# Altium project Insigni.PrjPcb
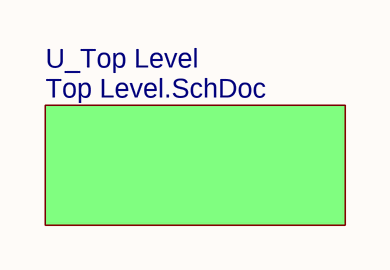
[diagram p0: System Diagram.SchDoc]
Revision: V1.0; DrawnBy: Ketan Desai; DateDrawn: 12-05-23
6 sheets, 6 parts. Net scope: global (net labels, ports and power ports of the same name join across sheets).
Sheets:
  System Diagram.SchDoc
    U_Top Level = Top Level.SchDoc
      U_MCU = MCU.SchDoc
      U_Analog Front End = Analog Front End.SchDoc
      U_CODEC = CODEC.SchDoc
      U_Power = Power.SchDoc

## Sheet System Diagram.SchDoc: System Diagram
size A4; SheetNumber: 1; SheetTotal: 6

### Sub-sheets
U_Top Level = Top Level.SchDoc: no entries

### Notes on the sheet
- TITLE
- DRAWN BY
- DATE
- PROJECT
- FILE
- SHEET SIZE
- A4
- REVISION
- PAGE
- of

## Sheet Top Level.SchDoc: Top Level
size A4; SheetNumber: 2; SheetTotal: 6
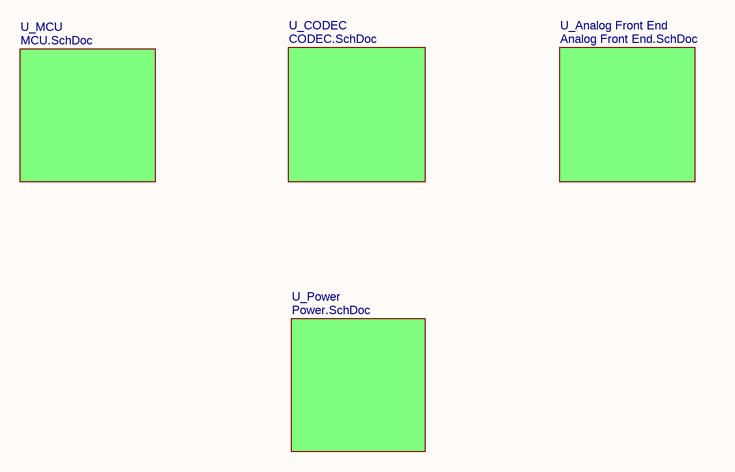
[diagram p1: Top Level.SchDoc]

### Sub-sheets
U_Analog Front End = Analog Front End.SchDoc: no entries
U_CODEC = CODEC.SchDoc: no entries
U_MCU = MCU.SchDoc: no entries
U_Power = Power.SchDoc: no entries

### Notes on the sheet
- TITLE
- DRAWN BY
- DATE
- PROJECT
- FILE
- SHEET SIZE
- A4
- REVISION
- PAGE
- of

## Sheet MCU.SchDoc: Microcontroller
size A4; SheetNumber: 3; SheetTotal: 6
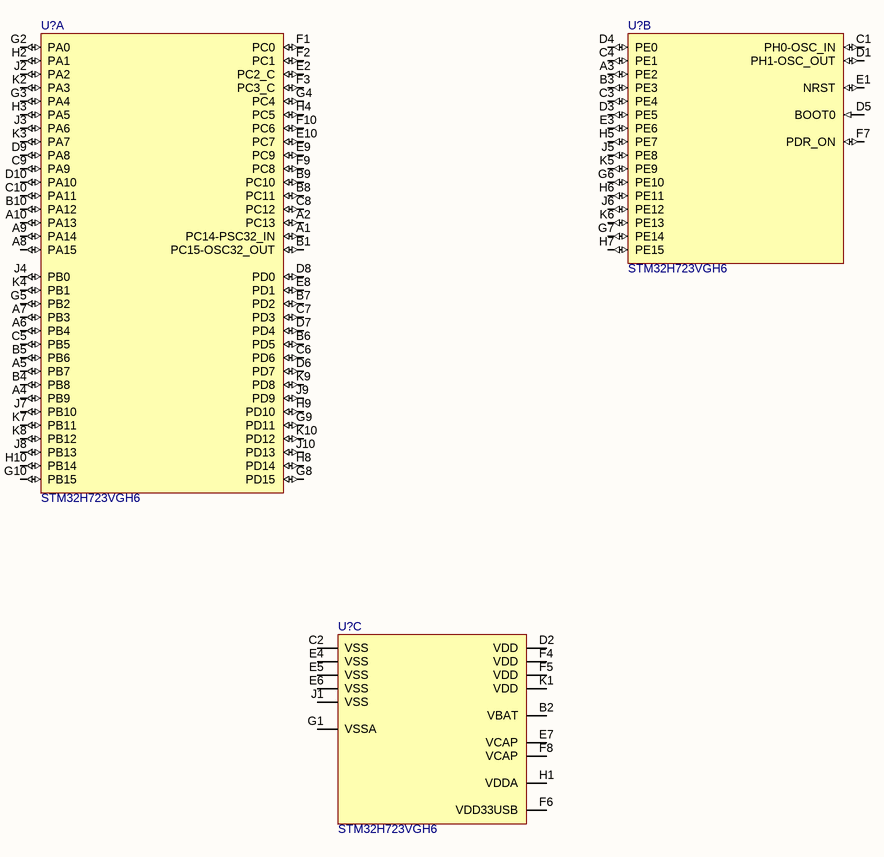
[diagram p2: MCU.SchDoc]

### Parts
(Parts that share a designator on the sheet are numbered #1, #2 ... from top to bottom, then left to right.)
U?#1  STM32H723VGH6  [TFBGA100_STM]  (part B of 3)
U?#2  STM32H723VGH6  [TFBGA100_STM]  (part A of 3)
U?#3  STM32H723VGH6  [TFBGA100_STM]  (part C of 3)

### Nets

Not connected (* = marked no-connect by the designer): U?#1 A3(PE2) B3(PE3) C1(PH0-OSC_IN) C3(PE4) C4(PE1) D1(PH1-OSC_OUT) D3(PE5) D4(PE0) D5(BOOT0) E1(NRST) E3(PE6) F7(PDR_ON) G6(PE10) G7(PE14) H5(PE7) H6(PE11) H7(PE15) J5(PE8) J6(PE12) K5(PE9) K6(PE13); U?#2 A1(PC14-PSC32_IN) A2(PC13) A4(PB9) A5(PB7) A6(PB4) A7(PB3) A8(PA15) A9(PA14) A10(PA13) B1(PC15-OSC32_OUT) B4(PB8) B5(PB6) B6(PD5) B7(PD2) B8(PC11) B9(PC10) B10(PA12) C5(PB5) C6(PD6) C7(PD3) C8(PC12) C9(PA9) C10(PA11) D6(PD7) D7(PD4) D8(PD0) D9(PA8) D10(PA10) E2(PC2_C) E8(PD1) E9(PC9) E10(PC7) F1(PC0) F2(PC1) F3(PC3_C) F9(PC8) F10(PC6) G2(PA0) G3(PA4) G4(PC4) G5(PB2) G8(PD15) G9(PD11) G10(PB15) H2(PA1) H3(PA5) H4(PC5) H8(PD14) H9(PD10) H10(PB14) J2(PA2) J3(PA6) J4(PB0) J7(PB10) J8(PB13) J9(PD9) J10(PD13) K2(PA3) K3(PA7) K4(PB1) K7(PB11) K8(PB12) K9(PD8) K10(PD12); U?#3 B2(VBAT) C2(VSS) D2(VDD) E4(VSS) E5(VSS) E6(VSS) E7(VCAP) F4(VDD) F5(VDD) F6(VDD33USB) F8(VCAP) G1(VSSA) H1(VDDA) J1(VSS) K1(VDD)

### Notes on the sheet
- TITLE
- DRAWN BY
- DATE
- PROJECT
- FILE
- SHEET SIZE
- A4
- REVISION
- PAGE
- of

### Library data of the parts
U?#1-U?#3 = STM32H723VGH6: ARM® Cortex®-M7 STM32H7 Microcontroller IC 32-Bit Single-Core 550MHz 1MB (1M x 8) FLASH 100-TFBGA (8x8); Manufacturer_Part_Number: STM32H723VGH6; Supplier 1: Digi-Key; Supplier 2: Mouser; Supplier 3: LCSC; Supplier Part Number 1: 497-STM32H723VGH6-ND; Supplier Part Number 2: 511-STM32H723VGH6; Supplier Part Number 3: C2848033

## Sheet Analog Front End.SchDoc: Analog Front End
size A4; SheetNumber: 5; SheetTotal: 6
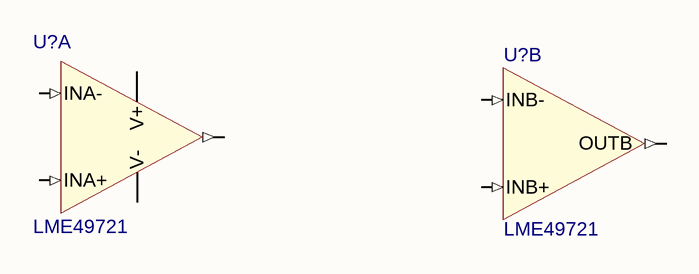
[diagram p3: Analog Front End.SchDoc]

### Parts
(Parts that share a designator on the sheet are numbered #1, #2 ... from top to bottom, then left to right.)
U?#4  LME49721  [SOIC-8N - LME49721]  (part A of 2)
U?#5  LME49721  [SOIC-8N - LME49721]  (part B of 2)

### Nets

Not connected (* = marked no-connect by the designer): U?#4 1(OUTA) 2(INA-) 3(INA+) 4(V-) 8(V+); U?#5 5(INB+) 6(INB-) 7(OUTB)

### Notes on the sheet
- TITLE
- DRAWN BY
- DATE
- PROJECT
- FILE
- SHEET SIZE
- A4
- REVISION
- PAGE
- of

### Library data of the parts
U?#4 U?#5 = LME49721: Audio Amplifier 2 Circuit Rail-to-Rail 8-SOIC; Supplier 1: Digi-Key; Supplier 2: Mouser; Supplier Part Number 3: C129347; Supplier Part Number 2: 926-LME49721MAX/NOPB; Supplier Part Number 1: 296-41312-1-ND; Supplier 3: LCSC

## Sheet CODEC.SchDoc: Codec
size A4; SheetNumber: 4; SheetTotal: 6
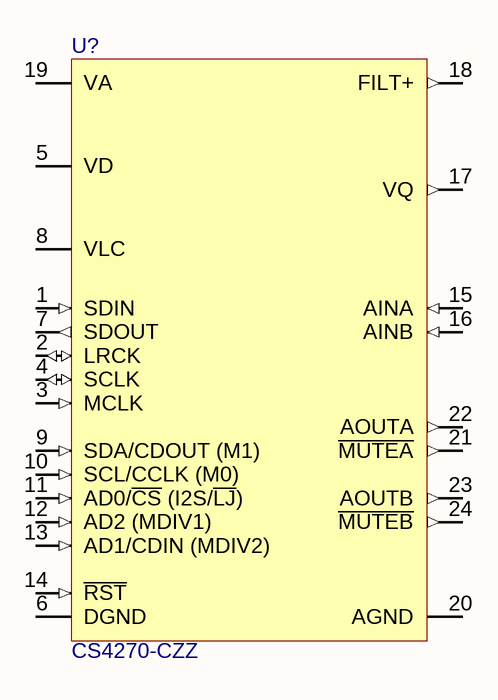
[diagram p4: CODEC.SchDoc]

### Parts
(Parts that share a designator on the sheet are numbered #1, #2 ... from top to bottom, then left to right.)
U?#6  CS4270-CZZ  [CIR-TSSOP-24-L]

### Nets

Not connected (* = marked no-connect by the designer): U?#6 1(SDIN) 2(LRCK) 3(MCLK) 4(SCLK) 5(VD) 6(DGND) 7(SDOUT) 8(VLC) 9(SDA/CDOUT_(M1)) 10(SCL/CCLK_(M0)) 11(AD0/~{CS}_(I2S/~{LJ})) 12(AD2_(MDIV1)) 13(AD1/CDIN_(MDIV2)) 14(~{RST}) 15(AINA) 16(AINB) 17(VQ) 18(FILT+) 19(VA) 20(AGND) 21(~{MUTEA}) 22(AOUTA) 23(AOUTB) 24(~{MUTEB})

### Notes on the sheet
- TITLE
- DRAWN BY
- DATE
- PROJECT
- FILE
- SHEET SIZE
- A4
- REVISION
- PAGE
- of

### Library data of the parts
U?#6 = CS4270-CZZ: IC CODEC 24BIT 105DB 24TSSOP; Supplier 1: Digi-Key; Supplier 2: Mouser; Supplier Part Number 1: 598-1040-5-ND; Supplier Part Number 2: 777-CS4270-CZZ

## Sheet Power.SchDoc: Power
size A4; SheetNumber: 1; SheetTotal: 1

### Notes on the sheet
- TITLE
- DRAWN BY
- DATE
- PROJECT
- FILE
- SHEET SIZE
- A4
- REVISION
- PAGE
- of